# EAGLE design anodeBoard (EAGLE 6.5.0)
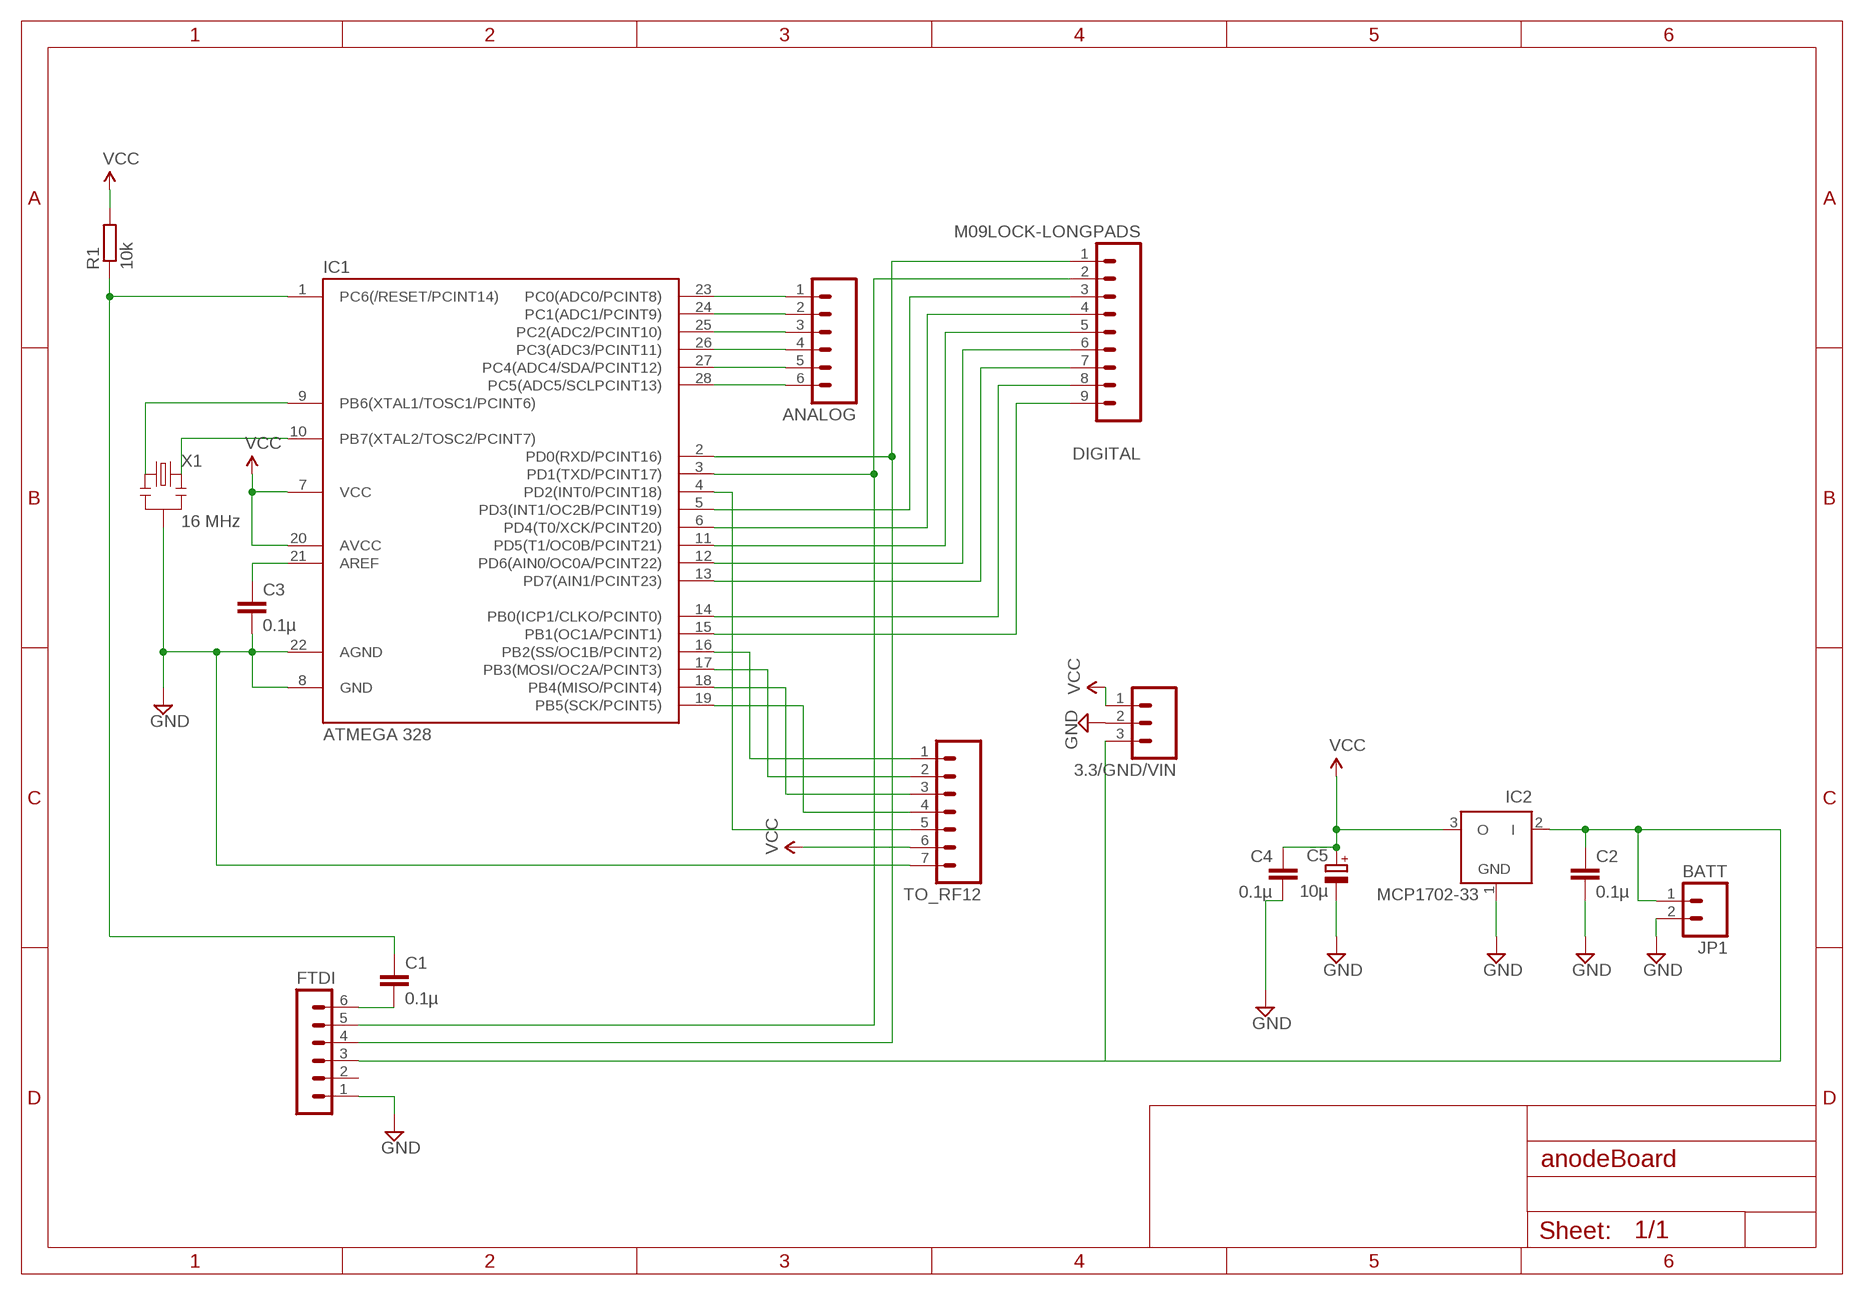
[diagram p0: schematic, sheet 1]

## Parts
3.3/GND/VIN  M03LOCK_LONGPADS  [1X03_LOCK_LONGPADS]
ANALOG  M06LOCK_LONGPADS  [1X06_LOCK_LONGPADS]
C1  0.1µ  C-EU025-024X044  [C025-024X044]
C2  0.1µ  C-EU025-024X044  [C025-024X044]
C3  0.1µ  C-EU025-024X044  [C025-024X044]
C4  0.1µ  C-EU025-024X044  [C025-024X044]
C5  10µ  CPOL-EUE1.8-4  [E1,8-4]
DIGITAL  M09LOCK-LONGPADS  [1X09_LOCK_LONGPADS]
FTDI  FTDI  MA06-1  [MA06-1]
IC1  ATMEGA 328  ATMEGA48/88/168-PU  [DIL28-3]
IC2  MCP1702-33  MCP1702Z  [TO92]
JP1  BATT  M02LOCK_LONGPADS  [1X02_LOCK_LONGPADS]
R1  10k  R-EU_0204/7  [0204/7]
TO_RF12  M07LOCK_LONGPADS  [1X07_LOCK_LONGPADS]
X1  16 MHz  RESONATORPTH  [RESONATOR-PTH]

## Nets
GND [power]: 3.3/GND/VIN.2 C2.2 C3.2 C4.2 C5.- FTDI.1 IC1.8(GND) IC1.22(AGND) IC2.1(GND) JP1.2 TO_RF12.7 X1.2
N$1: IC1.9(PB6(XTAL1/TOSC1/PCINT6)) X1.1
N$2: DIGITAL.3 IC1.5(PD3(INT1/OC2B/PCINT19))
N$3: DIGITAL.4 IC1.6(PD4(T0/XCK/PCINT20))
N$4: ANALOG.1 IC1.23(PC0(ADC0/PCINT8))
N$5: ANALOG.2 IC1.24(PC1(ADC1/PCINT9))
N$6: ANALOG.3 IC1.25(PC2(ADC2/PCINT10))
N$7: ANALOG.4 IC1.26(PC3(ADC3/PCINT11))
N$8: IC1.16(PB2(SS/OC1B/PCINT2)) TO_RF12.1
N$9: IC1.17(PB3(MOSI/OC2A/PCINT3)) TO_RF12.2
N$10: IC1.18(PB4(MISO/PCINT4)) TO_RF12.3
N$11: IC1.19(PB5(SCK/PCINT5)) TO_RF12.4
N$12: ANALOG.5 IC1.27(PC4(ADC4/SDA/PCINT12))
N$13: ANALOG.6 IC1.28(PC5(ADC5/SCLPCINT13))
N$14: IC1.4(PD2(INT0/PCINT18)) TO_RF12.5
N$15: DIGITAL.5 IC1.11(PD5(T1/OC0B/PCINT21))
N$16: DIGITAL.6 IC1.12(PD6(AIN0/OC0A/PCINT22))
N$17: DIGITAL.7 IC1.13(PD7(AIN1/PCINT23))
N$18: DIGITAL.8 IC1.14(PB0(ICP1/CLKO/PCINT0))
N$19: C3.1 IC1.21(AREF)
N$20: C1.2 FTDI.6
N$21: IC1.10(PB7(XTAL2/TOSC2/PCINT7)) X1.3
N$22: DIGITAL.9 IC1.15(PB1(OC1A/PCINT1))
PWR [power]: 3.3/GND/VIN.3 C2.1 FTDI.3 IC2.2(I) JP1.1
RST: C1.1 IC1.1(PC6(/RESET/PCINT14)) R1.1
RXD: DIGITAL.1 FTDI.4 IC1.2(PD0(RXD/PCINT16))
TXD: DIGITAL.2 FTDI.5 IC1.3(PD1(TXD/PCINT17))
VCC [power]: 3.3/GND/VIN.1 C4.1 C5.+ IC1.7(VCC) IC1.20(AVCC) IC2.3(O) R1.2 TO_RF12.6
Unconnected: FTDI.2

## Library data of the parts
3.3/GND/VIN = SparkFun-Connectors:M03: Header 3 Standard 3-pin 0.1" header. Use with straight break away headers (SKU : PRT-00116), right angle break away headers (PRT-00553), swiss pins (PRT-00743), machine pins (PRT-00117), and female headers (PRT-00115). Molex polarized connector foot print use with SKU : PRT-08232 with associated crimp pins and housings.
ANALOG = SparkFun-Connectors:M06: Header 6 Standard 6-pin 0.1" header. Use with straight break away headers (SKU : PRT-00116), right angle break away headers (PRT-00553), swiss pins (PRT-00743), machine pins (PRT-00117), and female headers (PRT-00115). Molex polarized connector foot print use with SKU : PRT-08094 with associated crimp pins and housings. NOTES ON THE VARIANTS LOCK and LOCK_LONGPADS... This footprint was designed to help hold the alignment of a through-hole component (i.e. 6-pin header) while soldering it into place. You may notice that each hole has been shifted either up or down by 0.005 of an inch from it's more standard position (which is a perfectly straight line). This slight alteration caused the pins (the squares in the middle) to touch the edges of the holes. Because they are alternating, it causes a "brace" to hold the component in place. 0.005 has proven to be the perfect amount of "off-center" position when using our standard breakaway headers. Although looks a little odd when you look at the bare footprint, once you have a header in there, the alteration is very hard to notice. Also,if you push a header all the way into place, it is covered up entirely on the bottom side. This idea of altering the position of holes to aid alignment will be further integrated into the Sparkfun Library for other footprints. It can help hold any component with 3 or more connection pins.
C1-C4 = resistor:C-EU: CAPACITOR, European symbol
C5 = resistor:CPOL-EU: POLARIZED CAPACITOR, European symbol
DIGITAL = SparkFun-Connectors:M09: Header 9 Standard 9-pin 0.1" header. Use with straight break away headers (SKU : PRT-00116), right angle break away headers (PRT-00553), swiss pins (PRT-00743), machine pins (PRT-00117), and female headers (PRT-00115).
FTDI = JeeLabs:MA06-1: PIN HEADER
IC1 = atmega8:ATMEGA48/88/168-PU
IC2 = JeeLabs:MCP1702: 200 mA, Low Power Low Dropout Voltage Regulator
JP1 = SparkFun:M02: Header 2 Standard 2-pin 0.1" header. Use with straight break away headers (SKU : PRT-00116), right angle break away headers (PRT-00553), swiss pins (PRT-00743), machine pins (PRT-00117), and female headers (PRT-00115). Molex polarized connector foot print use with SKU : PRT-08233 with associated crimp pins and housings.
R1 = resistor:R-EU_: RESISTOR, European symbol
TO_RF12 = SparkFun-Connectors:M07: Header 7 Standard 7-pin 0.1" header. Use with straight break away headers (SKU : PRT-00116), right angle break away headers (PRT-00553), swiss pins (PRT-00743), machine pins (PRT-00117), and female headers (PRT-00115). NOTES ON THE VARIANTS LOCK and LOCK_LONGPADS... This footprint was designed to help hold the alignment of a through-hole component (i.e. 7-pin header) while soldering it into place. You may notice that each hole has been shifted either up or down by 0.005 of an inch from it's more standard position (which is usually a perfectly straight line). This slight alteration caused the pins (the squares in the middle) to touch the edges of the holes. Because they are alternating, it causes a "brace" to hold the header in place. 0.005 has proven to be the perfect amount of "off-center" position when using our standard breakaway headers. Although looks a little odd when you look at the bare footprint, once you have a header in there, the alteration is very hard to notice. Also, if you push a header all the way into place, it is covered up entirely on the bottom side. This idea of altering the position of holes to aid alignment will be further integrated into the Sparkfun Library for other footprints. It can help hold any component with 3 or more connection pins.
X1 = SparkFun:RESONATOR: Resonator Small SMD resonator. This is the itty bitty 10/20MHz resonators with built in caps. CSTCE10M0G55 and CSTCE20M0V53. Footprint has been reviewed closely but hasn't been tested yet.

## Net classes
1 power: width 0.406 mm

## Board
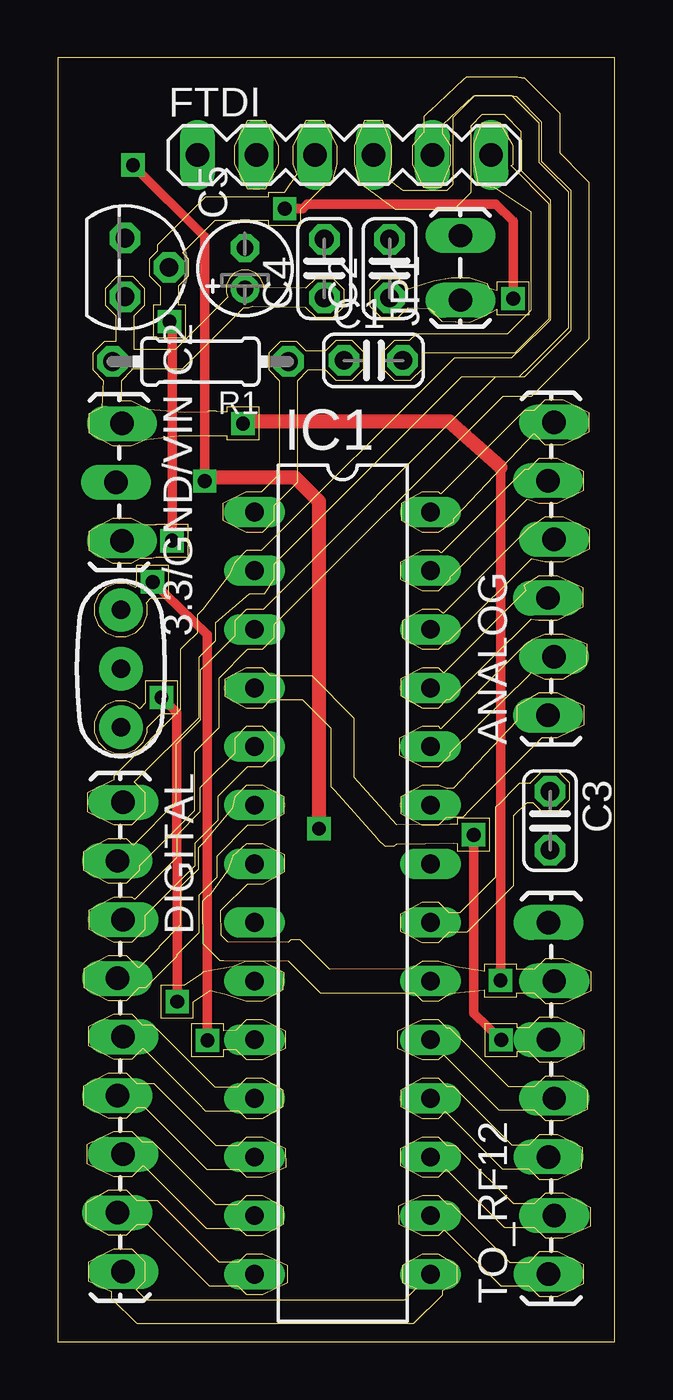
[diagram p1: board, top side]
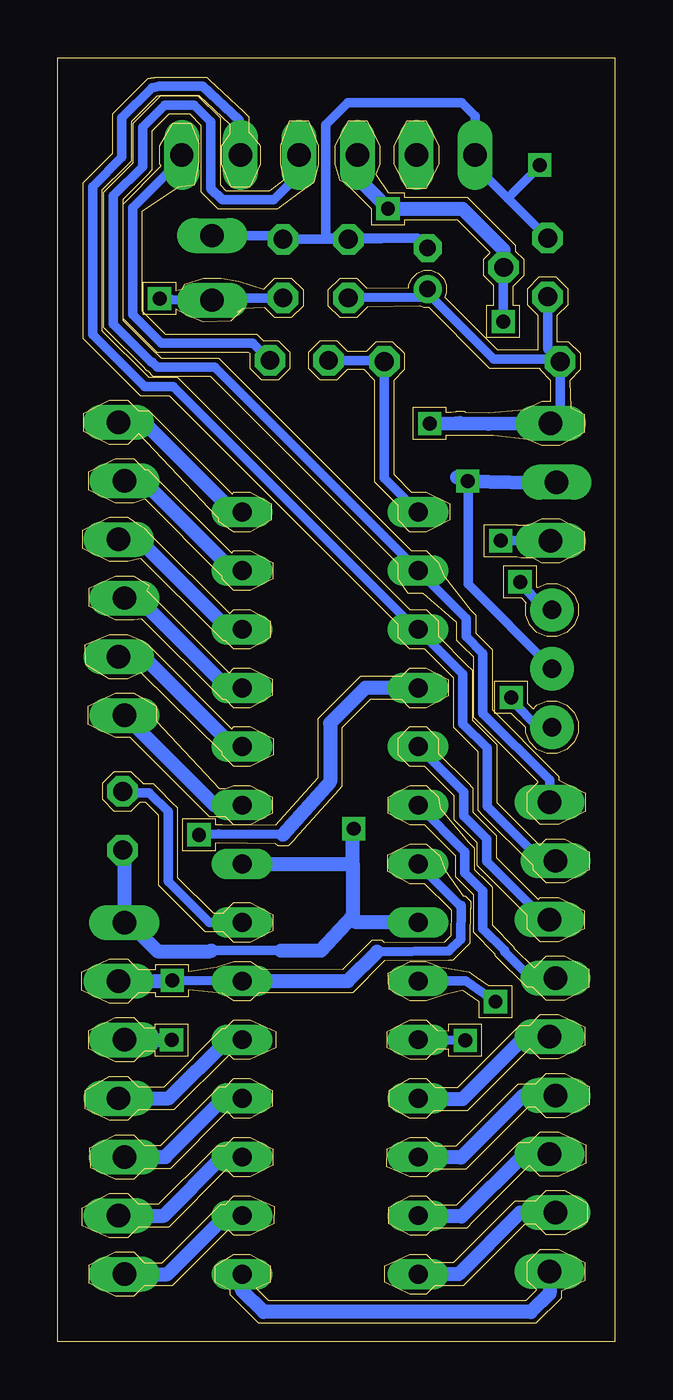
[diagram p2: board, bottom side, seen from below]

Size 24.13 x 55.63 mm. Coordinates in mm from the lower left corner, seen from the top.
Outline: 0,0 24.13,0 24.13,55.63 0,55.63 0,0
Copper layers (1*16): Top 0.035mm / dielectric 1.5mm / Bottom 0.035mm
Design rules "default": minimum track width 10mil, minimum drill 24mil, track to track 8mil, track to pad 8mil, pad to pad 8mil, via to via 8mil, smd to smd 8mil, copper to edge 40mil, drill to drill 8mil, minimum pad ring 10mil, minimum via ring 8mil, stop-mask expansion 4mil, vias tented up to drill 0mil, thermal gap 10mil
Milling: 898 lines

### Footprints (pad centres in the part's own frame; a part is rotated, then mirrored left to right if it is on the bottom)
1X03_LOCK_LONGPADS = drill 1.016 long: 1 0,0; 2 2.54,-0.254; 3 5.08,0
1X06_LOCK_LONGPADS = drill 1.016 long: 1 0,0; 2 2.54,-0.254; 3 5.08,0; 4 7.62,-0.254; 5 10.16,0; 6 12.7,-0.254
C025-024X044 = drill 0.813 octagon: 1 -1.27,0; 2 1.27,0
E1,8-4 = drill 0.711 pad 1.168: + -0.889,0 | drill 0.711 pad 1.168 octagon: - 0.889,0
1X09_LOCK_LONGPADS = drill 1.016 long: 1 0,0.127; 2 2.54,-0.127; 3 5.08,0.127; 4 7.62,-0.127; 5 10.16,0.127; 6 12.7,-0.127; 7 15.24,0.127; 8 17.78,-0.127; 9 20.32,0.127
MA06-1 = drill 1.016 long: 1 -6.35,0; 2 -3.81,0; 3 -1.27,0; 4 1.27,0; 5 3.81,0; 6 6.35,0
DIL28-3 = drill 0.813 long: 1 -16.51,-3.81; 2 -13.97,-3.81; 3 -11.43,-3.81; 4 -8.89,-3.81; 5 -6.35,-3.81; 6 -3.81,-3.81; 7 -1.27,-3.81; 8 1.27,-3.81; 9 3.81,-3.81; 10 6.35,-3.81; 11 8.89,-3.81; 12 11.43,-3.81; 13 13.97,-3.81; 14 16.51,-3.81; 15 16.51,3.81; 16 13.97,3.81; 17 11.43,3.81; 18 8.89,3.81; 19 6.35,3.81; 20 3.81,3.81; 21 1.27,3.81; 22 -1.27,3.81; 23 -3.81,3.81; 24 -6.35,3.81; 25 -8.89,3.81; 26 -11.43,3.81; 27 -13.97,3.81; 28 -16.51,3.81
TO92 = drill 0.813 octagon: 1 -1.27,0; 2 0,1.905; 3 1.27,0
1X02_LOCK_LONGPADS = drill 1.016 long: 1 -0.127,0; 2 2.667,0
0204/7 = drill 0.813 octagon: 1 -3.81,0; 2 3.81,0
1X07_LOCK_LONGPADS = drill 1.016 long: 1 0,0.127; 2 2.54,-0.127; 3 5.08,0.127; 4 7.62,-0.127; 5 10.16,0.127; 6 12.7,-0.127; 7 15.24,0.127
RESONATOR-PTH = drill 0.8 pad 1.88: 1 -2.54,0; 2 0,0; 3 2.54,0

### Placement (x,y rotation side)
3.3/GND/VIN  2.78,39.78 270 top
ANALOG  21.24,27.14 90 top
C1  13.67,42.51 0 top
C2  14.37,46.49 90 top
C3  21.32,22.57 270 top
C4  11.54,46.49 90 top
C5  8.11,46.49 90 top
DIGITAL  2.71,23.37 270 top
FTDI  12.41,51.42 0 top
IC1  12.33,19.44 270 top
IC2  2.91,46.54 270 top
JP1  17.44,45.25 90 top
R1  6.18,42.46 180 top
TO_RF12  21.37,2.93 90 top
X1  2.73,29.16 90 top

### Tracks (layer width: path | path; a pad name or v marks a point on that pad's centre or on a via)
GND  (via drill 0.6)
  Top 0.406: v6.37,37.28 6.37,47.87 v3.26,50.98
  Top 0.61: v11.32,22.23 11.32,36.4 10.28,37.44 6.53,37.44 v6.37,37.28
  Bottom 0.406: X1.2 2.73,29.19 6.36,32.82 6.36,37.27 v6.37,37.28 | 21.25,21.23 21.25,18.4 19.71,16.86 | JP1.2 14.53,47.92 C2.2 C4.2 8.53,47.8 C5.- 8.15,47.38 8.58,47.81 12.49,47.81 12.53,47.86 12.53,52.72 11.58,53.68 6.63,53.68 6.04,53.1 6.04,51.43 FTDI.1 6.06,50.96 4.65,49.54 | 4.65,49.54 IC2.1 | v3.26,50.98 3.26,50.94 4.65,49.54 | 17.47,16.95 14.47,16.95
  Bottom 0.61: 2.9,37.31 3.3/GND/VIN.2 2.67,37.21 v6.37,37.28 6.53,37.44 6.83,37.44 | TO_RF12.7 21.25,18.36 | C3.2 21.25,21.23 21.25,18.36 | IC1.22 11.39,20.71 11.35,20.67 | 11.35,20.67 11.35,22.2 v11.32,22.23 | 11.35,20.67 11.35,18.45 | 11.35,18.45 11.35,18.28 11.27,18.19 8.55,18.19 IC1.8 | 21.25,18.36 19.81,16.92 17.53,16.92 17.47,16.95 | 14.47,16.95 12.74,16.95 11.35,18.45
N$1  (via drill 0.6)
  Top 0.406: v5.17,14.74 5.15,27.26 v4.5,27.91
  Top 0.61: 4.48,27.91 v4.5,27.91
  Bottom 0.406: IC1.9 6.47,15.63 v5.17,14.74 | v4.5,27.91 4.5,27.8 3.28,26.58 2.78,26.58 X1.1
N$2
  Bottom 0.406: DIGITAL.3 3.04,18.29 5.55,20.8 5.55,21.78 6.55,22.77 6.55,23.82 IC1.5
N$3
  Bottom 0.406: DIGITAL.4 3.63,15.75 4.78,16.89 4.78,16.95 5.72,17.89 5.72,19.53 6.5,20.3 6.5,21.22 IC1.6
N$4
  Bottom 0.61: IC1.23 17.34,23.25 ANALOG.1
N$5
  Bottom 0.61: IC1.24 16.54,25.79 20.41,29.66 21.47,29.66 ANALOG.2
N$6
  Bottom 0.61: IC1.25 16.77,28.33 20.63,32.18 21.2,32.18 ANALOG.3
N$7
  Bottom 0.61: IC1.26 16.73,30.87 20.6,34.73 21.47,34.73 ANALOG.4
N$8
  Bottom 0.61: TO_RF12.1 19.39,2.93 16.85,5.46 IC1.16
N$9
  Bottom 0.61: TO_RF12.2 19.54,5.47 17.02,7.99 16.16,7.99 IC1.17
N$10
  Bottom 0.61: TO_RF12.3 19.47,8.01 16.94,10.54 16.15,10.54 IC1.18
N$11
  Bottom 0.61: TO_RF12.4 19.31,10.55 16.8,13.06 16.16,13.06 IC1.19
N$12
  Bottom 0.61: IC1.27 16.55,33.41 20.43,37.29 21.23,37.29 ANALOG.5
N$13
  Bottom 0.61: IC1.28 16.51,35.95 20.41,39.84 ANALOG.6
N$14  (via drill 0.6)
  Top 0.406: v18.01,21.96 18.02,14.22 v19.2,13.07
  Bottom 0.406: 14.37,21.98 17.17,22 v18.01,21.96
  Bottom 0.61: IC1.4 10.81,28.33 12.33,26.8 12.33,24.26 14.37,21.98 | TO_RF12.5 19.21,13.09 v19.2,13.07
N$15
  Bottom 0.61: DIGITAL.5 3.91,13.21 6.61,10.51 8.49,10.51 IC1.11
N$16
  Bottom 0.61: DIGITAL.6 3.98,10.67 6.66,7.99 8.5,7.99 IC1.12
N$17
  Bottom 0.61: DIGITAL.7 3.94,8.13 6.64,5.43 8.49,5.43 IC1.13
N$18
  Bottom 0.61: DIGITAL.8 4.12,5.59 6.78,2.93 IC1.14
N$19
  Bottom 0.406: IC1.21 17.57,18.17 19.35,19.95 19.35,22.97 20.16,23.77 21.25,23.77 C3.1
N$20
  Bottom 0.406: FTDI.6 18.76,51.25 20.89,49.12 20.89,44.5 19.64,43.26 15.68,43.26 C1.2
N$21  (via drill 0.6)
  Top 0.406: v6.49,13.06 6.49,30.64 v4.11,32.92
  Bottom 0.406: IC1.10 v6.49,13.06 | v4.11,32.92 2.9,31.53 X1.3
N$22
  Bottom 0.61: DIGITAL.9 2.83,2.1 3.64,1.3 15.22,1.3 16.16,2.24 16.16,2.91 IC1.15
PWR  (via drill 0.6)
  Top 0.406: v4.95,34.7 4.96,34.69 4.96,39.52 4.96,43.98 v4.84,44.2 | v9.83,49.09 10.6,49.09 10.8,49.28 18.97,49.28 19.72,48.53 v19.72,45.19 | v19.72,45.19
  Bottom 0.406: v4.95,34.7 3.3/GND/VIN.3 | C2.1 14.38,45.21 16.63,45.21 16.71,45.12 JP1.1 17.45,45.11 18.07,45.11 19.19,45.13 v19.72,45.19 | v4.84,44.2 4.84,46.52 IC2.2 4.82,47.3 | 9.87,49.19 v9.83,49.09
  Bottom 0.61: FTDI.3 11.14,50.4 v9.83,49.09 6.61,49.09 4.82,47.3
RST
  Bottom 0.406: C1.1 10.04,42.51 R1.1 9.99,37.41 IC1.1
  Bottom 0.61: IC1.1 8.58,35.95
RXD
  Bottom 0.406: DIGITAL.1 2.83,24.33 5.72,27.21 5.72,29.82 6.44,30.55 6.44,31.32 IC1.2 17.33,42.22 19.82,42.22 20.05,42.45 20.08,42.45 21.73,44.09 21.73,49.64 20.45,50.91 20.45,52.62 19.5,53.57 18.23,53.57 17.5,52.85 17.5,49.96 17.01,49.47 14.79,49.47 13.68,50.58 FTDI.4 13.7,51.44
TXD
  Bottom 0.406: DIGITAL.2 3.17,20.83 5.53,23.19 5.53,25.72 6.58,26.77 6.58,28.92 IC1.3 8.61,30.87 19.12,41.38 20.37,41.38 22.62,43.63 22.62,50.05 21.35,51.32 21.35,53.02 20.05,54.33 19.9,54.35 19.76,54.38 17.85,54.38 16.26,52.91 16.26,51.46 FTDI.5
VCC  (via drill 0.6)
  Top 0.406: v19.17,15.65 19.17,37.89
  Top 0.61: 19.17,37.89 16.96,39.87 7.87,39.87 v8.02,39.78
  Bottom 0.406: v19.17,15.65 IC1.20 | 10.3,16.9 7.19,16.92 6.68,17.43 6.66,18.91 6.73,18.91 IC1.7 | 6.7,39.91 v8.02,39.78 | C4.1 8.45,45.26 C5.+ 8.11,45.43 5.25,42.57 2.48,42.57 R1.2 | IC2.3 2.92,43.01 R1.2 | R1.2 2.37,40.19 3.3/GND/VIN.1
  Bottom 0.61: 2.94,39.76 3.3/GND/VIN.1 5.47,39.76 v8.02,39.78 | IC1.20 11.57,15.63 10.3,16.9 | TO_RF12.6 19.2,15.63 v19.17,15.65